# Altium schematic sheet ADS1299.SchDoc
size A4; Organization: Memristor-Robotics; Address1: Vladimira Perića Valtera; Address2: Novi Sad, 21000; Address3: Serbia; SheetNumber: 4; SheetTotal: 5
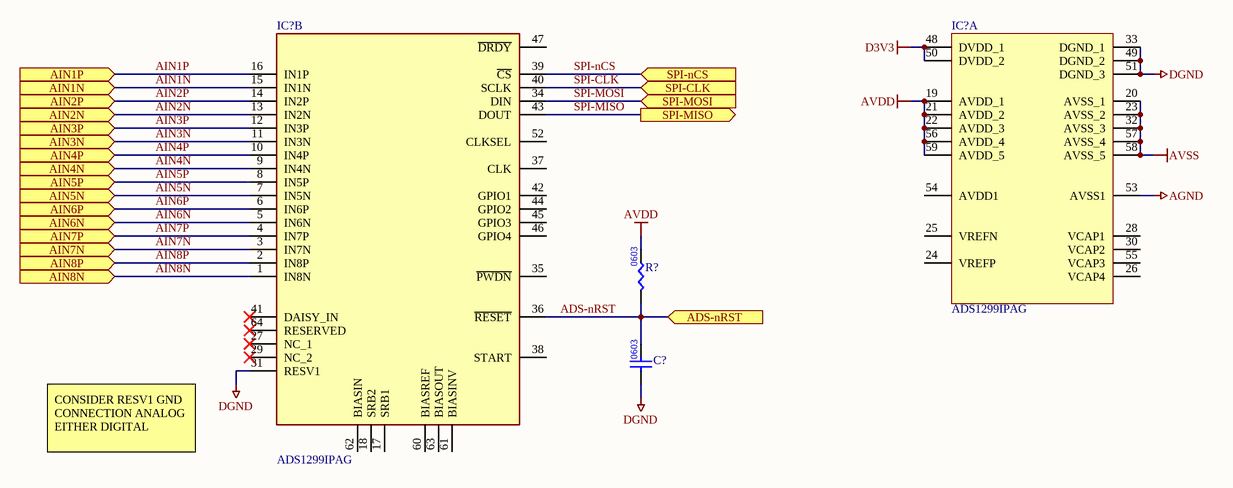
[diagram p0: ADS1299.SchDoc]

## Parts
(Parts that share a designator on the sheet are numbered #1, #2 ... from top to bottom, then left to right.)
C?  CAP_0603  [CAP0603]  (value not drawn)
IC?#1  ADS1299IPAG  [QFP50P1200X1200X120-64N]  (part B of 2)
IC?#2  ADS1299IPAG  [QFP50P1200X1200X120-64N]  (part A of 2)
R?  RES_0603  [RES0603]  (value not drawn)

## Ports
ADS-nRST (in), AIN1N (in), AIN1P (in), AIN2N (in), AIN2P (in), AIN3N (in), AIN3P (in), AIN4N (in), AIN4P (in), AIN5N (in), AIN5P (in), AIN6N (in), AIN6P (in), AIN7N (in), AIN7P (in), AIN8N (in), AIN8P (in), SPI-CLK (in), SPI-MISO (out), SPI-MOSI (in), SPI-nCS (in)

## Nets
AGND: IC?#2.53(AVSS1)
AVDD: IC?#2.19(AVDD_1) IC?#2.21(AVDD_2) IC?#2.22(AVDD_3) IC?#2.56(AVDD_4) IC?#2.59(AVDD_5) R?.2
AVSS: IC?#2.20(AVSS_1) IC?#2.23(AVSS_2) IC?#2.32(AVSS_3) IC?#2.57(AVSS_4) IC?#2.58(AVSS_5)
D3V3: IC?#2.48(DVDD_1) IC?#2.50(DVDD_2)
DGND: C?.1 IC?#1.31(RESV1) IC?#2.33(DGND_1) IC?#2.49(DGND_2) IC?#2.51(DGND_3)
ADS-nRST: C?.2 IC?#1.36(~{RESET}) R?.1 ; port ADS-nRST
AIN1N: IC?#1.15(IN1N) ; port AIN1N
AIN1P: IC?#1.16(IN1P) ; port AIN1P
AIN2N: IC?#1.13(IN2N) ; port AIN2N
AIN2P: IC?#1.14(IN2P) ; port AIN2P
AIN3N: IC?#1.11(IN3N) ; port AIN3N
AIN3P: IC?#1.12(IN3P) ; port AIN3P
AIN4N: IC?#1.9(IN4N) ; port AIN4N
AIN4P: IC?#1.10(IN4P) ; port AIN4P
AIN5N: IC?#1.7(IN5N) ; port AIN5N
AIN5P: IC?#1.8(IN5P) ; port AIN5P
AIN6N: IC?#1.5(IN6N) ; port AIN6N
AIN6P: IC?#1.6(IN6P) ; port AIN6P
AIN7N: IC?#1.3(IN7N) ; port AIN7N
AIN7P: IC?#1.4(IN7P) ; port AIN7P
AIN8N: IC?#1.1(IN8N) ; port AIN8N
AIN8P: IC?#1.2(IN8P) ; port AIN8P
SPI-CLK: IC?#1.40(SCLK) ; port SPI-CLK
SPI-MISO: IC?#1.43(DOUT) ; port SPI-MISO
SPI-MOSI: IC?#1.34(DIN) ; port SPI-MOSI
SPI-nCS: IC?#1.39(~{CS}) ; port SPI-nCS

Not connected (* = marked no-connect by the designer): IC?#1 17(SRB1) 18(SRB2) 27(NC_1)* 29(NC_2)* 35(~{PWDN}) 37(CLK) 38(START) 41(DAISY_IN)* 42(GPIO1) 44(GPIO2) 45(GPIO3) 46(GPIO4) 47(~{DRDY}) 52(CLKSEL) 60(BIASREF) 61(BIASINV) 62(BIASIN) 63(BIASOUT) 64(RESERVED)*; IC?#2 24(VREFP) 25(VREFN) 26(VCAP4) 28(VCAP1) 30(VCAP2) 54(AVDD1) 55(VCAP3)

## Notes on the sheet
- CONSIDER RESV1 GND CONNECTION ANALOG EITHER DIGITAL
- Title
- Date:
- Design Engineer:
- Time:
- Revision:
- Sheet
- of
- Size:
- A4
- www.memristor-robotics.io
- File:
- (in symbol RES_0603) 0603

## Library data of the parts
C? = CAP_0603: Generic 0603 cap; Manufacturer 1: *; Manufacturer Part Number 1: *; Supplier 1: *; Supplier Part Number 1: *; Value: *; Voltage Rating: *; Package: 0603; Mounting Type: Surface Mount
IC?#1 IC?#2 = ADS1299: Integrated Circuit; Manufacturer: Texas Instruments; Height: 1.2mm; Manufacturer Part Number: ADS1299IPAG; ComponentLink1Description: Datasheet; ComponentLink1URL: http://www.ti.com/lit/ds/symlink/ads1299.pdf; Supplier 1: Mouser; Supplier Part Number 1: 595-ADS1299IPAGR
R? = RES_0603: Generic 0603 resistor